# EAGLE design CoffeeCounter (EAGLE 9.6.0)
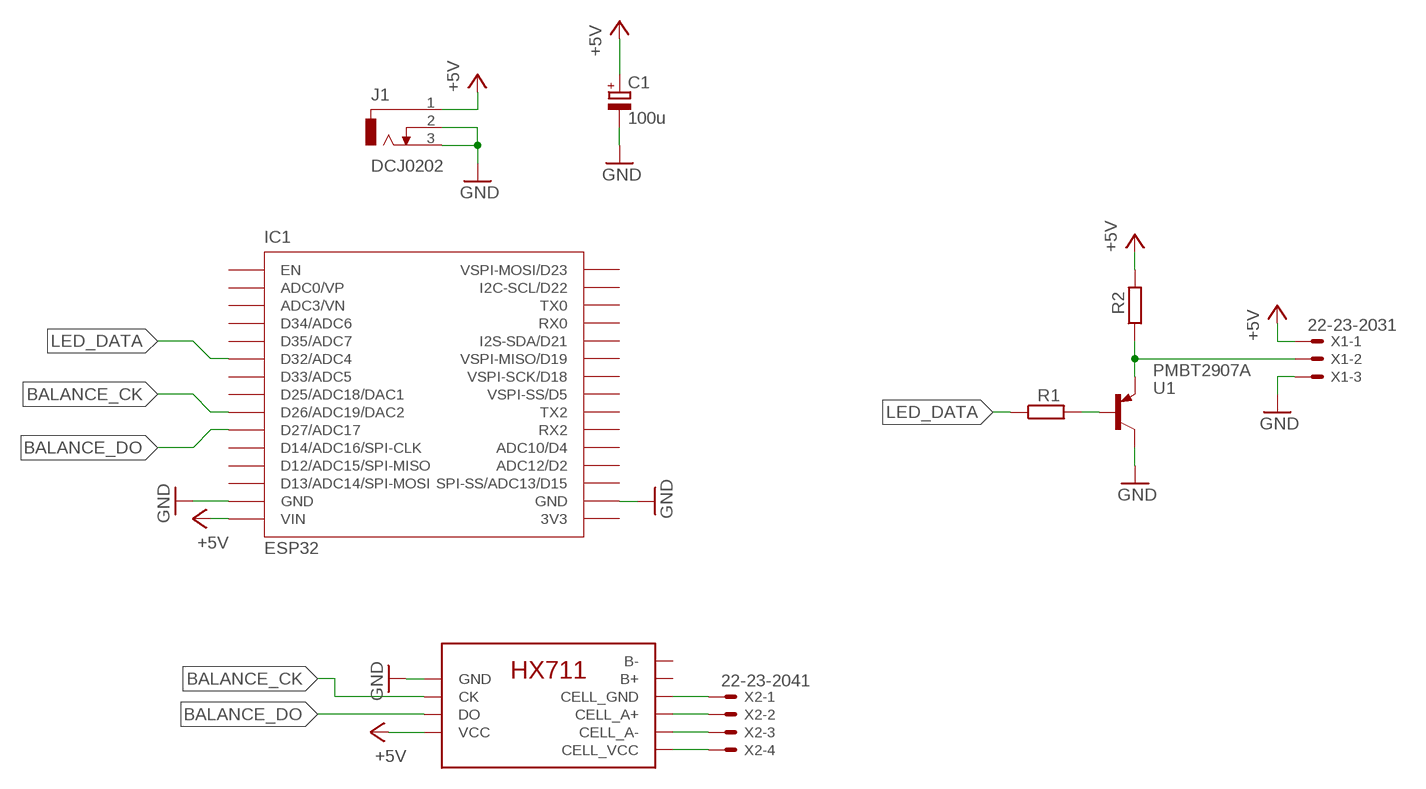
[diagram p0: schematic, sheet 1]

## Parts
C1  100u  CPOL-EUE3.5-8  [E3,5-8]
IC1  ESP32  [ESP32]
J1  DCJ0202  [DCJ0202]
R1  R-EU_R0603  [R0603]
R2  R-EU_R0603  [R0603]
U1  PMBT2907A  [SOT23_NEX]
U$1  HX711_BREAKOUT  [HX711_BREAKOUT]
X1  22-23-2031  [22-23-2031]
X2  22-23-2041  [22-23-2041]

## Nets
+5V: C1.+ IC1.VIN J1.1 R2.2 U$1.VCC X1.1
BALANCE_CK: IC1.D26(D26/ADC19/DAC2) U$1.CK
BALANCE_DO: IC1.D27(D27/ADC17) U$1.DO
GND: C1.- IC1.GND@1(GND) IC1.GND@2(GND) J1.2 J1.3 U1.3(C) U$1.GND X1.3
LED_DATA: IC1.D32(D32/ADC4) R1.1
N$1: R1.2 U1.1(B)
N$2: R2.1 U1.2(E) X1.2
N$3: U$1.CELL_GND X2.1
N$4: U$1.CELL_A+ X2.2
N$5: U$1.CELL_A- X2.3
N$6: U$1.CELL_OUT+(CELL_VCC) X2.4
Unconnected: IC1.D2(ADC12/D2) IC1.D4(ADC10/D4) IC1.D5(VSPI-SS/D5) IC1.D12(D12/ADC15/SPI-MISO) IC1.D14(D14/ADC16/SPI-CLK) IC1.D15(SPI-SS/ADC13/D15) IC1.D18(VSPI-SCK/D18) IC1.D19(VSPI-MISO/D19) IC1.D21(I2S-SDA/D21) IC1.D22(I2C-SCL/D22) IC1.D23(VSPI-MOSI/D23) IC1.D25(D25/ADC18/DAC1) IC1.D33(D33/ADC5) IC1.D34(D34/ADC6) IC1.D35(D35/ADC7) IC1.EN IC1.RX0 IC1.RX2 IC1.TX0 IC1.TX2 IC1.VP(ADC0/VP) U$1.B+ U$1.B-

## Power pins joined to a net without a drawn wire
3V3: IC1.3V3
ADC3/VN: IC1.VN(ADC3/VN)
D13/ADC14/SPI-MOSI: IC1.D13(D13/ADC14/SPI-MOSI)

## Library data of the parts
C1 = rcl:CPOL-EU: POLARIZED CAPACITOR, European symbol; SPICEPREFIX: C
IC1 = RONI:ESP32
J1 = RONI:DCJ0202: DC POWER JACK Source: DCJ0202.pdf; OC_FARNELL: unknown; OC_NEWARK: unknown
R1 R2 = rcl:R-EU_: RESISTOR, European symbol; SPICEPREFIX: R
U1 = RONI:PMBT2907A; COPYRIGHT: Copyright (C) 2016 Accelerated Designs. All rights reserved; MANUFACTURER_PART_NUMBER: PMBT2907A; SOURCELIBRARY: Nexperia_2018-05-2018; VENDOR: Nexperia
U$1 = RONI:HX711_BREAKOUT
X1 = con-molex:22-23-2031: .100" (2.54mm) Center Header - 3 Pin; MF: MOLEX; MPN: 22-23-2031; OC_FARNELL: 1462950; OC_NEWARK: 30C0862
X2 = con-molex:22-23-2041: .100" (2.54mm) Center Header - 4 Pin; MF: MOLEX; MPN: 22-23-2041; OC_FARNELL: 1462920; OC_NEWARK: 38C0355

## Board
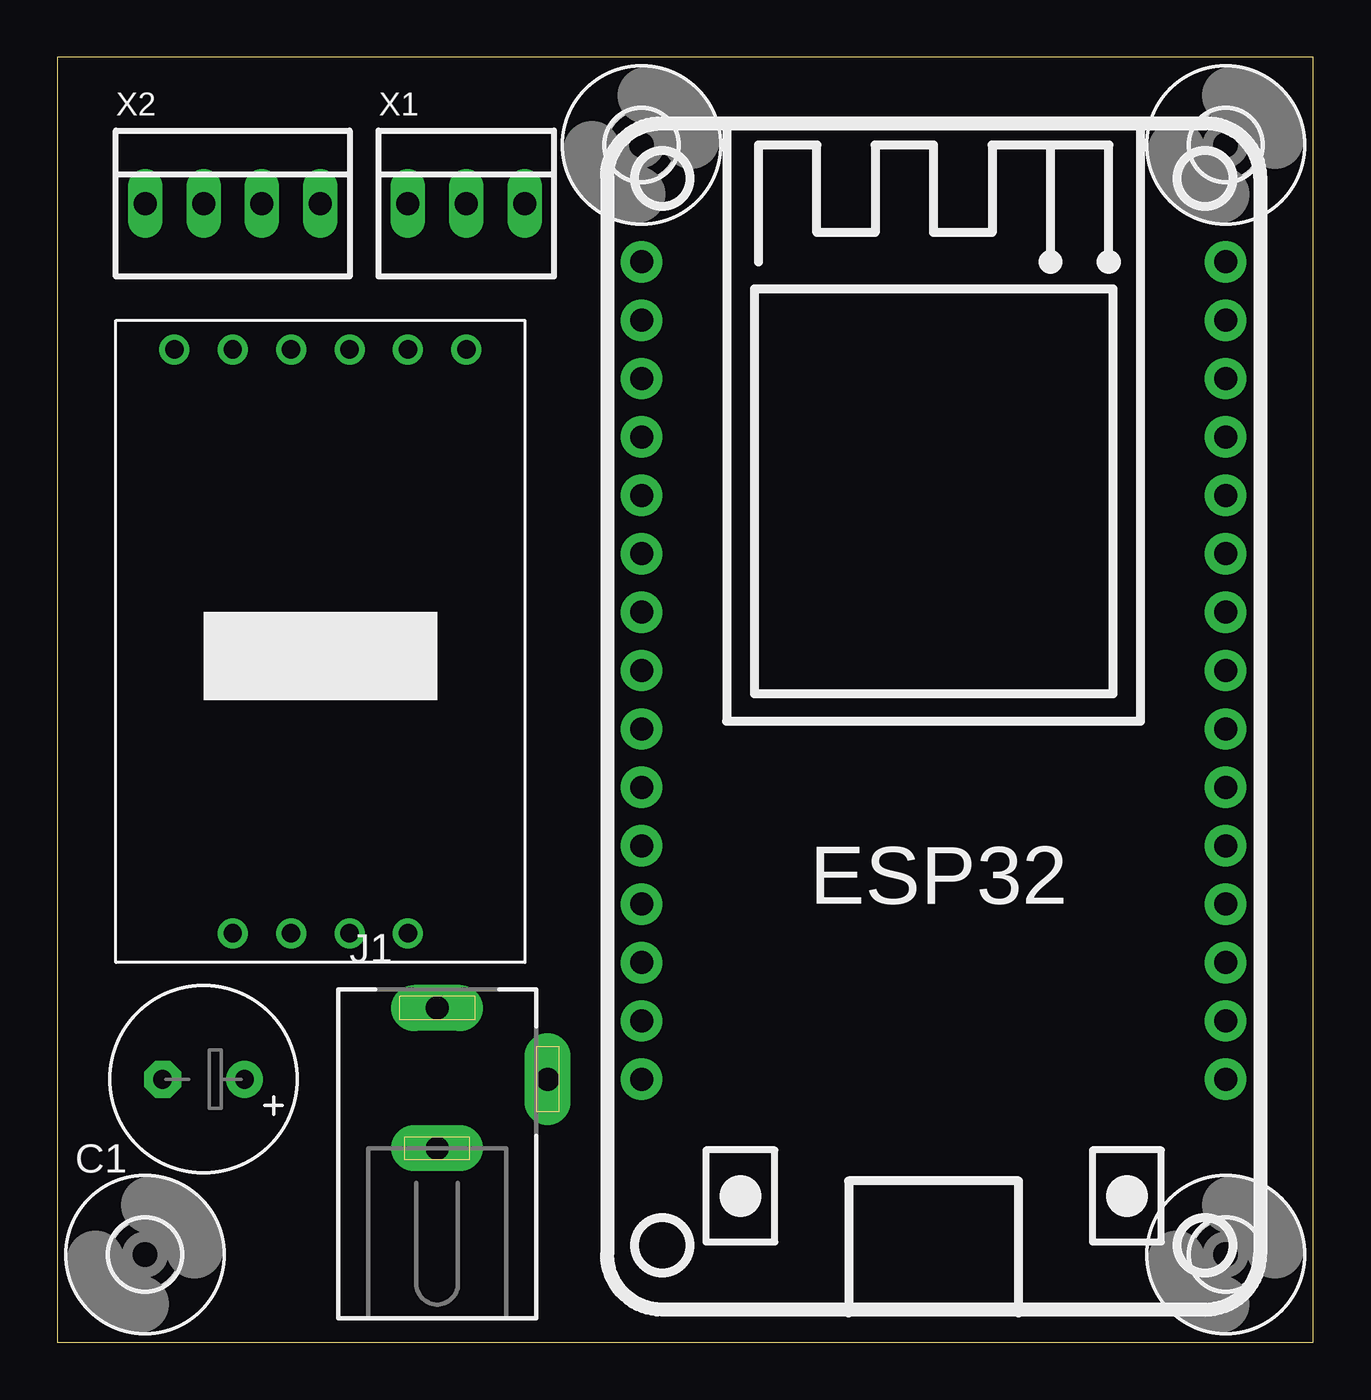
[diagram p1: board, top side]
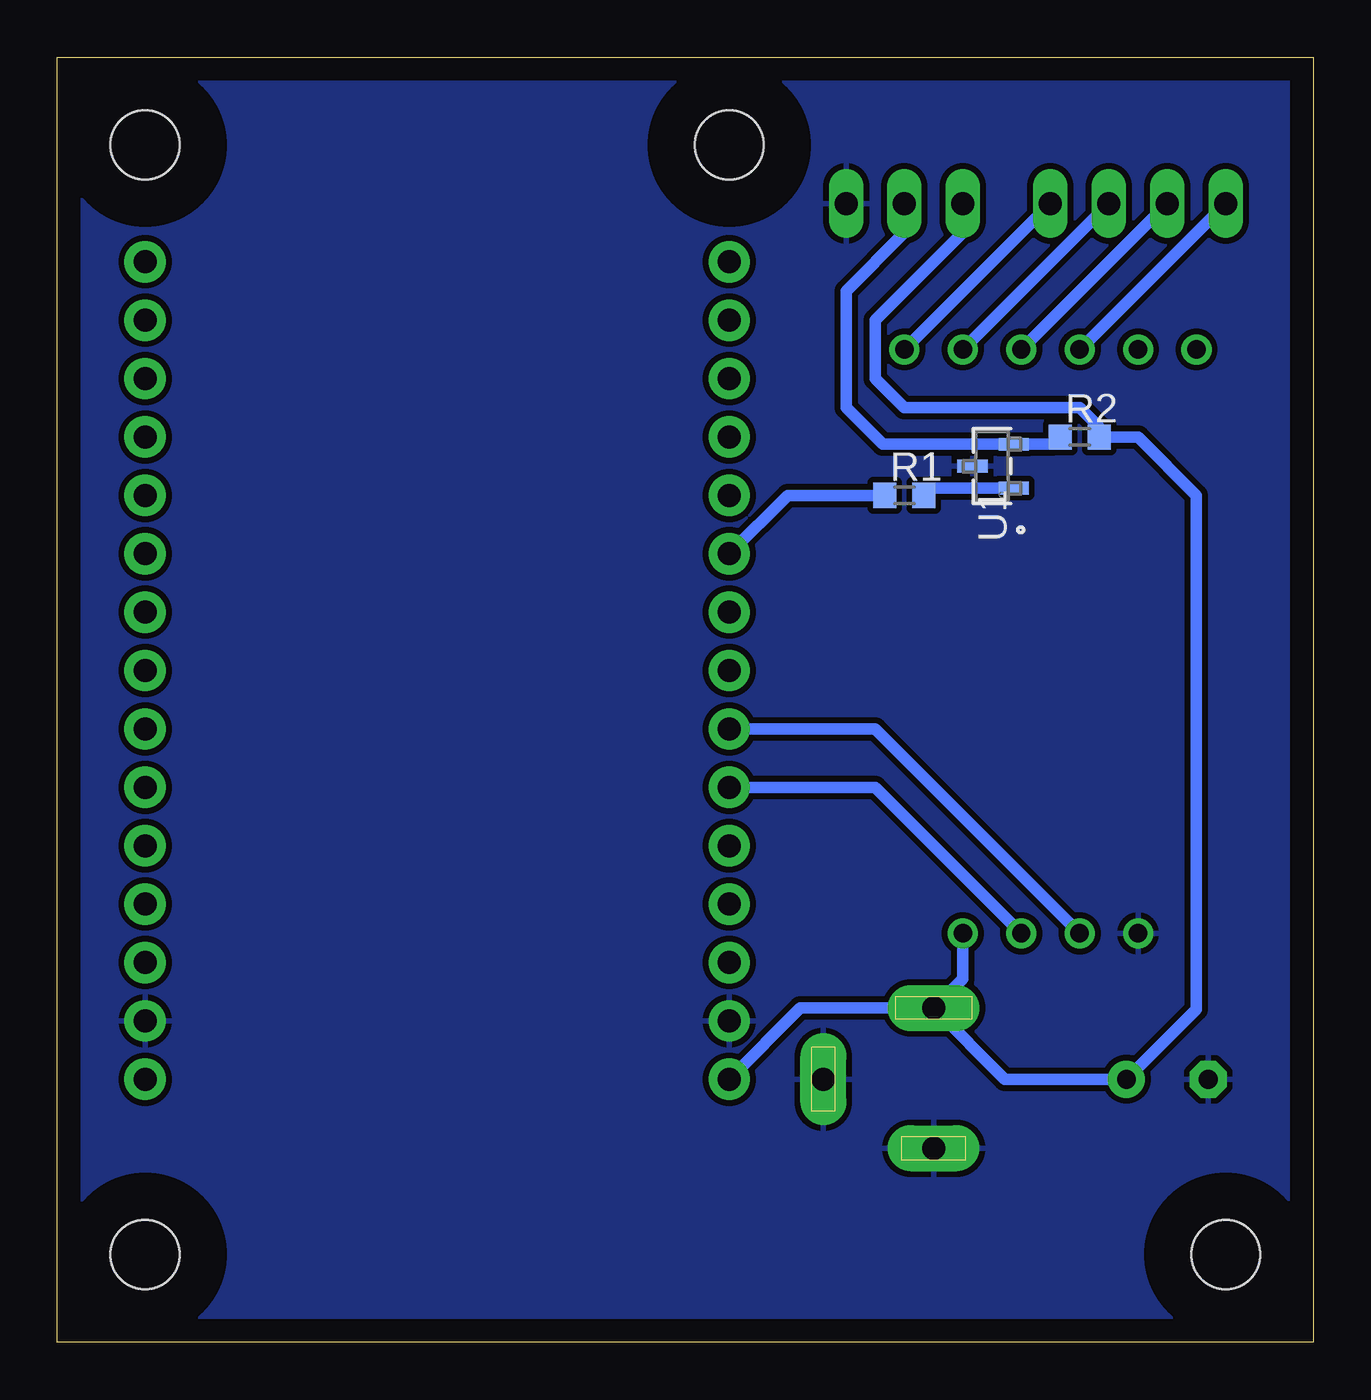
[diagram p2: board, bottom side, seen from below]

Size 54.61 x 55.88 mm. Coordinates in mm from the lower left corner, seen from the top.
Outline: 0,0 54.61,0 54.61,55.88 0,55.88 0,0
Copper layers (1*16): Top 0.035mm / dielectric 1.5mm / Bottom 0.035mm
Design rules "default *": minimum track width 10mil, minimum drill 0.8mm, track to track 10mil, track to pad 10mil, pad to pad 10mil, via to via 10mil, smd to smd 6mil, copper to edge 40mil, drill to drill 10mil, minimum pad ring 10mil, minimum via ring 8mil, stop-mask expansion 4mil, vias tented up to drill 0mil, thermal gap 10mil

### Footprints (pad centres in the part's own frame; a part is rotated, then mirrored left to right if it is on the bottom)
E3,5-8 = drill 0.813 pad 1.6: + -1.778,0 | drill 0.813 pad 1.6 octagon: - 1.778,0
ESP32 = drill 1 pad 1.8: 3V3 12.7,-12.7; D2 12.7,-5.08; D4 12.7,-2.54; D5 12.7,5.08; D12 -12.7,-5.08; D13 -12.7,-7.62; D14 -12.7,-2.54; D15 12.7,-7.62; D18 12.7,7.62; D19 12.7,10.16; D21 12.7,12.7; D22 12.7,20.32; D23 12.7,22.86; D25 -12.7,5.08; D26 -12.7,2.54; D27 -12.7,0; D32 -12.7,10.16; D33 -12.7,7.62; D34 -12.7,15.24; D35 -12.7,12.7; EN -12.7,22.86; GND@1 -12.7,-10.16; GND@2 12.7,-10.16; RX0 12.7,15.24; RX2 12.7,0; TX0 12.7,17.78; TX2 12.7,2.54; VIN -12.7,-12.7; VN -12.7,17.78; VP -12.7,20.32
DCJ0202 = drill 1 pad 2 long: 1 0,3.1; 2 4.8,0; 3 0,-3
R0603 = smd 1 x 1.1: 1 -0.85,0; 2 0.85,0
SOT23_NEX = smd 0.559 x 1.321: 1 -0.953,-0.945; 2 0.953,-0.945; 3 0,0.847
HX711_BREAKOUT = drill 0.8: B+ 25.4,7.62; B- 25.4,10.16; CELL_A+ 25.4,2.54; CELL_A- 25.4,0; CELL_GND 25.4,5.08; CELL_OUT+ 25.4,-2.54; CK 0,5.08; DO 0,2.54; GND 0,7.62; VCC 0,0
LOCH_M3 = hole 3: 0,0
22-23-2031 = drill 1 long: 1 -2.54,0; 2 0,0; 3 2.54,0
22-23-2041 = drill 1 long: 1 -3.81,0; 2 -1.27,0; 3 1.27,0; 4 3.81,0

### Placement (x,y rotation side)
C1  6.35,11.43 180 top
IC1  38.1,24.13 0 top
J1  16.51,11.43 0 top
R1  17.78,36.83 0 bottom
R2  10.16,39.37 0 bottom
U1  13.97,38.1 90 bottom
U$1  15.24,17.78 90 top
U$2  [LOCH_M3]  3.81,3.81 0 top
U$3  [LOCH_M3]  25.4,52.07 0 top
U$4  [LOCH_M3]  50.8,3.81 0 top
U$5  [LOCH_M3]  50.8,52.07 0 top
X1  17.78,49.53 0 top
X2  7.62,49.53 0 top

### Tracks (layer width: path | path; a pad name or v marks a point on that pad's centre or on a via)
+5V
  Bottom 0.508: J1.1 22.3,14.53 IC1.VIN | J1.1 15.24,15.8 U$1.VCC | X1.1 15.24,48.26 19.05,44.45 19.05,41.91 17.78,40.64 10.16,40.64 9.31,39.79 R2.2 7.62,39.37 5.08,36.83 5.08,14.48 C1.+ 13.41,11.43 J1.1
BALANCE_CK
  Bottom 0.508: U$1.CK 19.05,26.67 IC1.D26
BALANCE_DO
  Bottom 0.508: U$1.DO 19.05,24.13 IC1.D27
GND
  pour Bottom: -1.27,58.42 55.88,58.42 55.88,-2.54 -1.27,-2.54
LED_DATA
  Bottom 0.508: R1.1 22.86,36.83 IC1.D32
N$1
  Bottom 0.508: U1.1 16.61,37.15 R1.2
N$2
  Bottom 0.508: R2.1 11.33,39.05 U1.2 18.73,39.05 20.32,40.64 20.32,45.72 17.78,48.26 X1.2
N$3
  Bottom 0.508: X2.1 U$1.CELL_GND
N$4
  Bottom 0.508: X2.2 U$1.CELL_A+
N$5
  Bottom 0.508: X2.3 U$1.CELL_A-
N$6
  Bottom 0.508: X2.4 U$1.CELL_OUT+